# Altium schematic sheet 电机驱动模块.SchDoc
size A4
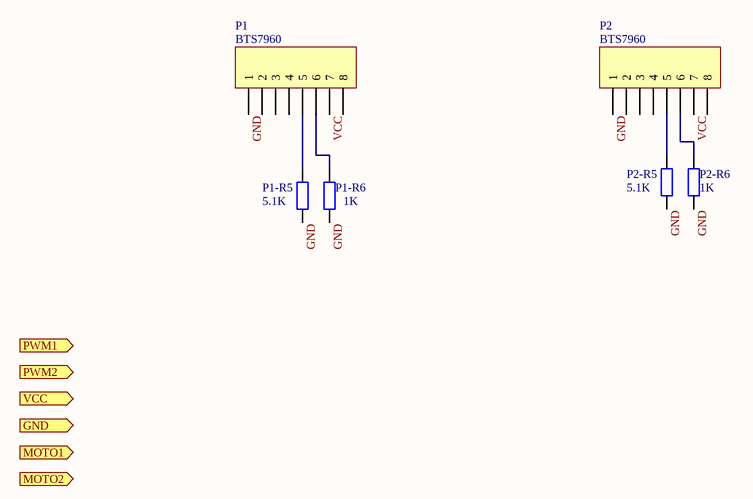
[diagram p0: 电机驱动模块.SchDoc]

## Parts
P1  BTS7960
P1-R5  5.1K  [0805]
P1-R6  1K  [0805]
P2  BTS7960
P2-R5  5.1K  [0805]
P2-R6  1K  [0805]

## Ports
GND (out), MOTO1 (in), MOTO2 (in), PWM1 (out), PWM2 (out), VCC (out)

## Nets
GND: P1.1 P1-R5.1 P1-R6.1 P2.1 P2-R5.1 P2-R6.1
VCC: P1.7 P2.7
NetP1_5: P1.5 P1-R5.2
NetP1_6: P1.6 P1-R6.2
NetP2_5: P2.5 P2-R5.2
NetP2_6: P2.6 P2-R6.2

Not connected (* = marked no-connect by the designer): P1 2 3 4 8; P2 2 3 4 8

## Library data of the parts
P1 P2 = Header 8: Header, 8-Pin; LatestRevisionDate: 17-Jul-2002; LatestRevisionNote: Re-released for DXP Platform.; Publisher: Altium Limited
P1-R5 P1-R6 P2-R5 P2-R6 = Res2: Resistor; Published: 8-Jun-2000; LatestRevisionDate: 17-Jul-2002; LatestRevisionNote: Re-released for DXP Platform.; Publisher: Altium Limited